# Altium schematic sheet THS7002CPWP_Schematic_2.SchDoc
size A; SheetNumber: 15; SheetTotal: 15
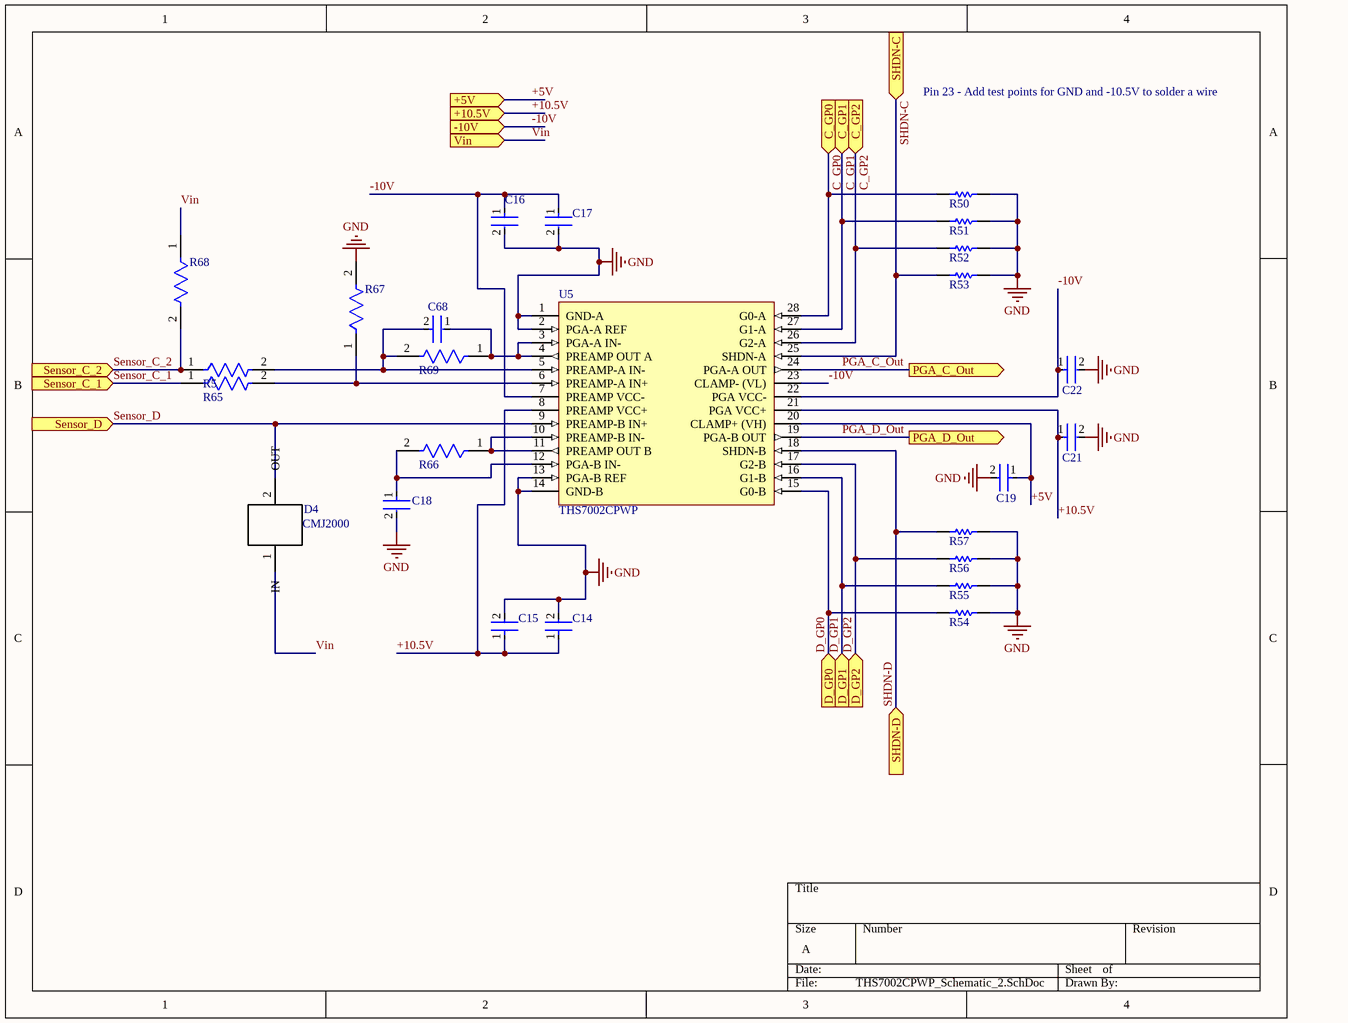
[diagram p0: THS7002CPWP_Schematic_2.SchDoc]

## Parts
C14  (no value)  [FP-C2012-060-0_2-IPC_A]
C15  CC0603KRX7R7BB104  [FP-CC0603-DA-MFG]  (value not drawn)
C16  CC0603KRX7R7BB104  [FP-CC0603-DA-MFG]  (value not drawn)
C17  (no value)  [FP-C2012-060-0_2-IPC_A]
C18  GRM2195C1H622JA01D  [FP-GRM219-0_1-IPC_C]  (value not drawn)
C19  (no value)  [FP-C2012-060-0_2-IPC_A]
C21  CC0603KRX7R7BB104  [FP-CC0603-DA-MFG]  (value not drawn)
C22  CC0603KRX7R7BB104  [FP-CC0603-DA-MFG]  (value not drawn)
C68  GRM31CR60J227ME11K  [FP-GRM31C-0_3-e0_3_0_9-IPC_C]  (value not drawn)
D4  CMJ2000  [CMJ2000_Footprint]
R5  CRCW0603499RFKEA  [FP-CRCW0603-e3-MFG]  (value not drawn)
R50  RC0603FR-073K3L  [RESC1608X55X25ML10T15]  (value not drawn)
R51  RC0603FR-073K3L  [RESC1608X55X25ML10T15]  (value not drawn)
R52  RC0603FR-073K3L  [RESC1608X55X25ML10T15]  (value not drawn)
R53  RC0603FR-073K3L  [RESC1608X55X25ML10T15]  (value not drawn)
R54  RC0603FR-073K3L  [RESC1608X55X25ML10T15]  (value not drawn)
R55  RC0603FR-073K3L  [RESC1608X55X25ML10T15]  (value not drawn)
R56  RC0603FR-073K3L  [RESC1608X55X25ML10T15]  (value not drawn)
R57  RC0603FR-073K3L  [RESC1608X55X25ML10T15]  (value not drawn)
R65  CRCW0603499RFKEA  [FP-CRCW0603-e3-MFG]  (value not drawn)
R66  CRCW0603499RFKEA  [FP-CRCW0603-e3-MFG]  (value not drawn)
R67  CRCW0603499RFKEA  [FP-CRCW0603-e3-MFG]  (value not drawn)
R68  RC0603FR-07100KL  [FP-RC0603-0_55-MFG]  (value not drawn)
R69  CRCW0603499RFKEA  [FP-CRCW0603-e3-MFG]  (value not drawn)
U5  THS7002CPWP  [THS7002CPWP]

## Ports
+5V (in), +10.5V (in), -10V (in), C_GP0 (in), C_GP1 (in), C_GP2 (in), D_GP0 (in), D_GP1 (in), D_GP2 (in), PGA_C_Out (out), PGA_D_Out (out), Sensor_C_1 (in), Sensor_C_2 (in), Sensor_D (in), SHDN-C (in), SHDN-D (in), Vin (in)

## Nets
GND: C14.2 C15.2 C16.2 C17.2 C18.2 C19.2 C21.2 C22.2 R50.1 R51.1 R52.1 R53.1 R54.1 R55.1 R56.1 R57.1 R67.2 U5.1(GND-A) U5.2(PGA-A_REF) U5.13(PGA-B_REF) U5.14(GND-B)
+5V: C19.1 U5.20(CLAMP+_(VH)) ; port +5V
+10.5V: C14.1 C15.1 C21.1 U5.8(PREAMP_VCC+) U5.21(PGA_VCC+) ; port +10.5V
-10V: C16.1 C17.1 C22.1 U5.7(PREAMP_VCC-) U5.22(PGA_VCC-) U5.23(CLAMP-_(VL)) ; port -10V
C_GP0: R50.2 U5.28(G0-A) ; port C_GP0
C_GP1: R51.2 U5.27(G1-A) ; port C_GP1
C_GP2: R52.2 U5.26(G2-A) ; port C_GP2
D_GP0: R54.2 U5.15(G0-B) ; port D_GP0
D_GP1: R55.2 U5.16(G1-B) ; port D_GP1
D_GP2: R56.2 U5.17(G2-B) ; port D_GP2
PGA_C_Out: U5.24(PGA-A_OUT) ; port PGA_C_Out
PGA_D_Out: U5.19(PGA-B_OUT) ; port PGA_D_Out
Sensor_C_1: R65.1 ; port Sensor_C_1
Sensor_C_2: R5.1 R68.2 ; port Sensor_C_2
Sensor_D: U5.9(PREAMP-B_IN+) ; port Sensor_D
SHDN-C: R53.2 U5.25(SHDN-A) ; port SHDN-C
SHDN-D: R57.2 U5.18(SHDN-B) ; port SHDN-D
Vin: R68.1 ; port Vin
NetC18_1: C18.1 R66.2 U5.12(PGA-B_IN-)
NetC68_1: C68.1 R69.1 U5.3(PGA-A_IN-) U5.4(PREAMP_OUT_A)
NetC68_2: C68.2 R5.2 R69.2 U5.5(PREAMP-A_IN-)
NetR65_2: R65.2 R67.1 U5.6(PREAMP-A_IN+)
NetR66_1: R66.1 U5.10(PREAMP-B_IN-) U5.11(PREAMP_OUT_B)

Not connected (* = marked no-connect by the designer): D4 1(IN) 2(OUT)

## Notes on the sheet
- Pin 23 - Add test points for GND and -10.5V to solder a wire

## Library data of the parts
C14 C17 C19 = CMP-08246-004641-1: Multilayer Ceramic Capacitors 6.8μF ±10% 10V JB SMD 0805; Capacitance: 6.8uF; RoHS Compliant: Yes; Case Code (Metric): 5032; Case/Package: 0805; Voltage Rating: 10V; Width: 0.049inch; Min Operating Temperature: -25°C; Mount: Surface Mount; Voltage Rating (DC): 10V; Dielectric Material: Ceramic; Case Code (Imperial): 2012; Package Quantity: 4000; Lead Free: Lead Free; Packaging: Tape and Reel; Length: 0.079inch; Tolerance: 10%; Thickness: 0.028inch; Max Operating Temperature: 85°C; Series: C
C15 C16 C21 C22 = CMP-2000-05002-2: CAP CER 0.1UF 16V X7R 0603; Manufacturer: YAGEO; Tolerance: 0.1; Value: 100 nF; Temperature Coefficient: 15%; Material: Ceramic; Voltage Rating: 16 V; Package: CC0603-DA; ComponentLink2Description: Datasheet; Octopart: https://octopart.com/cc0603krx7r7bb104-yageo-192941; Temperature Range High: +125°C; Digikey Description: CAP CER 0.1UF 16V X7R 0603; Voltage: 16 V; Device Class L2: Capacitors; Height: 0.9mm; Temperature: -55°C to +125°C; Manufacturer Part Number: CC0603KRX7R7BB104; Device Class L1: Passive Components; Device Class L3: Ceramic Capacitors; ComponentLink2URL: http://www.yageo.com/documents/recent/UPY-GPHC_X7R_6.3V-to-50V_18.pdf; Footprint Url: http://www.yageo.com/exep/pages/download/literatures/UPY-C_GEN_24.pdf; RoHS: TRUE; Temperature Range Low: -55°C; Temperature Characteristic: X7R; Lead Free: Yes; Capacitance: 100 nF; Category: Cap; Mouser Description: Multilayer Ceramic Capacitor, CC Series, 0.1 - F, - 10%, X7R, 16 V, 0603 [1608 Metric]; Automotive: No
C18 = CMP-2007-00144-2: Chip Multilayer Ceramic Capacitors for General Purpose, 0805, 6200pF, C0G, 30ppm/°C, 5%, 50V; Capacitance: 6.2nF; Termination: SMD/SMT; Tolerance: 5%; Radiation Hardening: No; Voltage: 50V; Lead Free: Lead Free; Case Code (Imperial): 0805; Width: 0.049inch; Thickness: 0.037inch; Depth: 1.25mm; Mount: Surface Mount; Length: 2mm; Packaging: Tape and Reel; Voltage Rating (DC): 50V; Case/Package: 0805; Height: 0.85mm; Package Quantity: 1; Dielectric: C0G; Min Operating Temperature: -55°C; Max Operating Temperature: 125°C; Voltage Rating: 50V; Case Code (Metric): 2012
C68 = CMP-06035-026847-1: Chip Multilayer Ceramic Capacitors for General Purpose, 1206, 220uF, X5R, 15%, 20%, 6.3V; Thickness: 1.6mm; Tolerance: 20%; Length: 3.2mm; Width: 1.6mm; Dielectric: X5R; Voltage Rating (DC): 6.3V; Capacitance: 220uF
D4 = CMJ2000: DIODE CUR REG 100V 2.32MA 500MW; ComponentLink1Description: New link; ComponentLink1URL: *
R5 R65-R67 R69 = CMP-2000-03390-2: RES Thick Film, 499Ω, 1%, 0.1W, 100ppm/°C, 0603; Voltage Rating (DC): 75V; Power Rating: 100mW; Resistance: 499R; Case/Package: 0603; Package Quantity: 5000; Military Standard: Not; Length: 1.55mm; Width: 0.85mm; Number of Terminations: 2; Lead Free: Lead Free; Height: 0.45mm; Weight: 7.1E-05oz; Composition: Thick Film; Radiation Hardening: No; Max Operating Temperature: 155°C; Tolerance: 1%; Working Voltage: 75V; Temperature Coefficient: 100ppm/°C; Packaging: Tape and Reel; Contact Plating: Tin; Termination: SMD/SMT; Depth: 0.85mm; Case Code (Metric): 1608; Min Operating Temperature: -55°C; Mount: Surface Mount; Case Code (Imperial): 0603; Voltage Rating: 75V
R50-R57 = CMP-1012-00567-2: Chip Resistor, 3.3 KOhm, +/- 1%, 0.1 W, -55 to 155 degC, 0603 (1608 Metric), RoHS, Tape and Reel; Manufacturer: Yageo; Temperature Coefficient: 100ppm/degreesC; Voltage Rating: 50V; Max Power Dissipation: 100mW; Resistance: 3.3KOhm; Case Code (Metric): 1608; Case/Package: 0603; Composition: ThickFilm; RoHSCompliant: true; Datasheet Version: Rev. 5, 10/2016; REACH SVHC: NoSVHC; Width: 0.8mm; Package Quantity: 1; Depth: 0.8mm; Voltage Rating (DC): 50V; Termination: SMD/SMT; Length: 1.6mm; Lead Free: LeadFree; Package Description: 2-Pin Surface Mount Device, Body 1.6 x 0.8 mm; Max Operating Temperature: 155degC; Tolerance: 1%; Height: 0.45mm; Number of Pins: 2; Military Standard: Not; Power Rating: 100mW; Datasheet URL: http://www.yageo.com/NewPortal/yageodocoutput?fileName=/pdf/R-Chip/PYu-RC_Group_51_RoHS_L_5.pdf; Case Code (Imperial): 0603; Manufacturer URL: http://www.yageo.com/; Packaging: TapeandReel; Min Operating Temperature: -55degC; Package Reference: 0603; Number of Terminations: 2
R68 = CMP-2100-03662-2: RES SMD 100K OHM 1% 1/10W 0603; Voltage Rating (DC): 50V; Resistance: 100kR; Max Power Dissipation: 100mW; Temperature Coefficient: 100ppm/°C; Working Voltage: 75V; Length: 1.6mm; Lead Free: Lead Free; Number of Terminations: 2; Packaging: Tape and Reel; Voltage Rating: 50V; Termination: SMD/SMT; Width: 0.8mm; Resistor Type: Thick Film; Resistance Tolerance: 1%; Features: Moisture Resistant; Height: 0.45mm; Construction: Rectangular; Case/Package: 0603; Military Standard: Not; Case Code (Imperial): 0603; Series: RC; Technology: THICK FILM; Depth: 0.8mm; RoHS Compliant: Yes; REACH SVHC: No SVHC; Min Operating Temperature: -55°C; Case Code (Metric): 1608; Max Operating Temperature: 155°C; Power Rating: 100mW; Number of Pins: 2; Tolerance: 1%
U5 = CMP-0988-00132-2: 70-MHz High-Speed Programmable-Gain Amplifier, Dual, 0 to 70 degC, 28-pin SOP (PWP28), Green (RoHS & no Sb/Br); Manufacturer: Texas Instruments; Disable: TRUE; BW @ Acl(MHz): 100; Vs(Min)(V): 9; Vs(Max)(V): 32; Number of Channels: 2; Vio(Max)(mV): 7; Iib(Max)(nA): 6000; SubFamily: Variable Gain Amplifier; Vn at Flatband(Typ)(nV/rtHz): 1.7; Slew Rate(Typ)(V/us): 85; ComponentLink1Description: Manufacturer URL; Code_JEDEC: MO-153; PackageVersion: 4073225-6/I, 05/2011; PackageReference: PWP0028E; Eco-Plan: Green (RoHS & no Sb/Br); ComponentLink2URL: http://www.ti.com/general/docs/lit/getliterature.tsp?genericPartNumber=THS7002&fileType=pdf; PackageDescription: 28-Pin Plastic Small Outline, Body 4.4 x 9.7 mm, Pitch 0.65 mm; DatasheetVersion: SLOS214C; ComponentLink3URL: http://www.ti.com/litv/pdf/mpds373; ComponentLink3Description: Package Specification; ComponentLink1URL: http://www.ti.com/; ComponentLink2Description: Datasheet; Mounting Technology: Surface Mount; PartNumber: THS7002CPWP